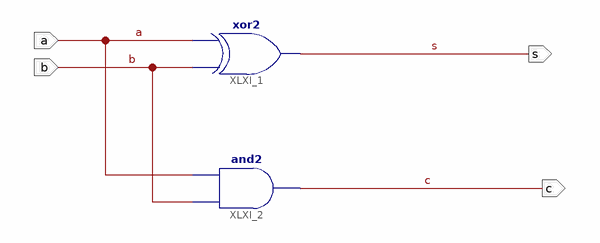
[diagram p0: schematic sheet 1]
// Xilinx ISE schematic demiadd.sch (spartan3e) as structural Verilog: 2 symbols, 4 ports
module demiadd (
  input  b,
  input  a,
  output c,
  output s
);

  xor XLXI_1 (s, b, a);
  and XLXI_2 (c, b, a);
endmodule
